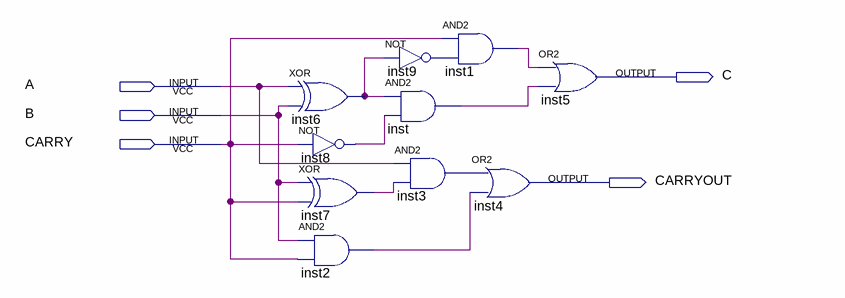
[diagram p0: schematic sheet]
// Quartus schematic OneBitFA.bdf as structural Verilog: 10 symbols, 5 pins
module OneBitFA (
  input  A,
  input  B,
  input  CARRY,
  output C,
  output CARRYOUT
);

  wire inst1_out, inst2_out, inst3_out, inst6_out, inst7_out, inst8_out, inst9_out, inst_out;

  xor inst6 (inst6_out, A, B);
  not inst8 (inst8_out, CARRY);
  xor inst7 (inst7_out, B, CARRY);
  and inst2 (inst2_out, B, CARRY);
  not inst9 (inst9_out, inst6_out);
  and inst (inst_out, inst6_out, inst8_out);
  and inst3 (inst3_out, A, inst7_out);
  and inst1 (inst1_out, CARRY, inst9_out);
  or inst4 (CARRYOUT, inst3_out, inst2_out);
  or inst5 (C, inst1_out, inst_out);
endmodule
